# Altium schematic sheet LEDMiniCube_AAmp.SchDoc
size A4
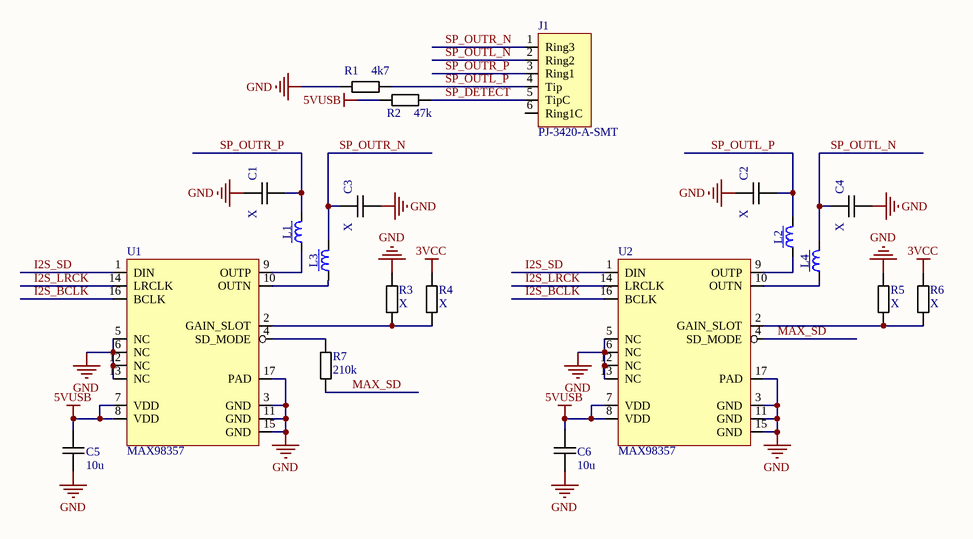
[diagram p0: LEDMiniCube_AAmp.SchDoc]

## Parts
C1  X  [CAPC2012L]
C2  X  [CAPC2012L]
C3  X  [CAPC2012L]
C4  X  [CAPC2012L]
C5  10u  [CAPC2012L]
C6  10u  [CAPC2012L]
J1  PJ-3420-A-SMT  [PJ-3420-A-SMT]
L1  (no value)  [INDC2012L]
L2  (no value)  [INDC2012L]
L3  (no value)  [INDC2012L]
L4  (no value)  [INDC2012L]
R1  4k7  [RESC1608L]
R2  47k  [RESC1608L]
R3  X  [RESC1608L]
R4  X  [RESC1608L]
R5  X  [RESC1608L]
R6  X  [RESC1608L]
R7  210k  [RESC1608L]
U1  MAX98357  [PQFN50P300X300X80_HS-17N]
U2  MAX98357  [PQFN50P300X300X80_HS-17N]

## Nets
3VCC: R4.2 R6.2
5VUSB: C5.2 C6.2 R2.1 U1.7(VDD) U1.8(VDD) U2.7(VDD) U2.8(VDD)
GND: C1.1 C2.1 C3.2 C4.2 C5.1 C6.1 R1.1 R3.2 R5.2 U1.3(GND) U1.5(NC) U1.6(NC) U1.11(GND) U1.12(NC) U1.13(NC) U1.15(GND) U1.17(PAD) U2.3(GND) U2.5(NC) U2.6(NC) U2.11(GND) U2.12(NC) U2.13(NC) U2.15(GND) U2.17(PAD)
I2S_BCLK: U1.16(BCLK) U2.16(BCLK)
I2S_LRCK: U1.14(LRCLK) U2.14(LRCLK)
I2S_SD: U1.1(DIN) U2.1(DIN)
MAX_SD: R7.2 U2.4(SD_MODE)
SP_DETECT: J1.5(TipC) R2.2
SP_OUTL_N: C4.1 J1.2(Ring2) L4.2
SP_OUTL_P: C2.2 J1.4(Tip) L2.2 R1.2
SP_OUTR_N: C3.1 J1.1(Ring3) L3.2
SP_OUTR_P: C1.2 J1.3(Ring1) L1.2
NetL1_1: L1.1 U1.9(OUTP)
NetL2_1: L2.1 U2.9(OUTP)
NetL3_1: L3.1 U1.10(OUTN)
NetL4_1: L4.1 U2.10(OUTN)
NetR3_1: R3.1 R4.1 U1.2(GAIN_SLOT)
NetR5_1: R5.1 R6.1 U2.2(GAIN_SLOT)
NetR7_1: R7.1 U1.4(SD_MODE)

Not connected (* = marked no-connect by the designer): J1 6(Ring1C)

## Library data of the parts
C1-C6 = Capacitor: Name: *; Case: *
  C1-C4: Value: X
  C5 C6: Value: 10u
J1 = 3.5 socket PJ-3420-A-SMT: Name: PJ-3420-A-SMT; Part: *
L1-L4 = IND_150NH_2%_COILCRAFT_0805CS: Inductor With Core; Author: CERN DEM JLC
R1-R7 = Resistor: Model: *; Case: *
  R1: Value: 4k7
  R2: Value: 47k
  R3-R6: Value: X
  R7: Value: 210k
U1 U2 = MAX98357: Part: MAX98357A; Name: MAX98357